# EAGLE schematic flipflop-t-from-jk (EAGLE 6.3)
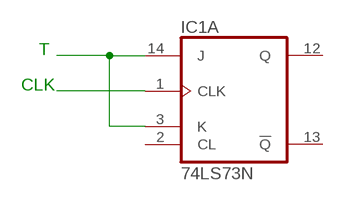
[diagram p0: schematic, sheet 1]

## Parts
IC1  74LS73N  [DIL14]

## Nets
N$1: IC1.3(A:K)
N$2: IC1.1(A:CLK)
Unconnected: IC1.2(A:CL) IC1.5(B:CLK) IC1.6(B:CL) IC1.7(B:J) IC1.8(B:!Q) IC1.9(B:Q) IC1.10(B:K) IC1.12(A:Q) IC1.13(A:!Q) IC1.14(A:J)

## Notes on the sheet
- T
- CLK

## Power pins joined to a net without a drawn wire
GND: IC1.11(P:GND)
VCC: IC1.4(P:VCC)

## Library data of the parts
IC1 = 74xx-eu:74*73: Dual J-K FLIP FLOP, clear